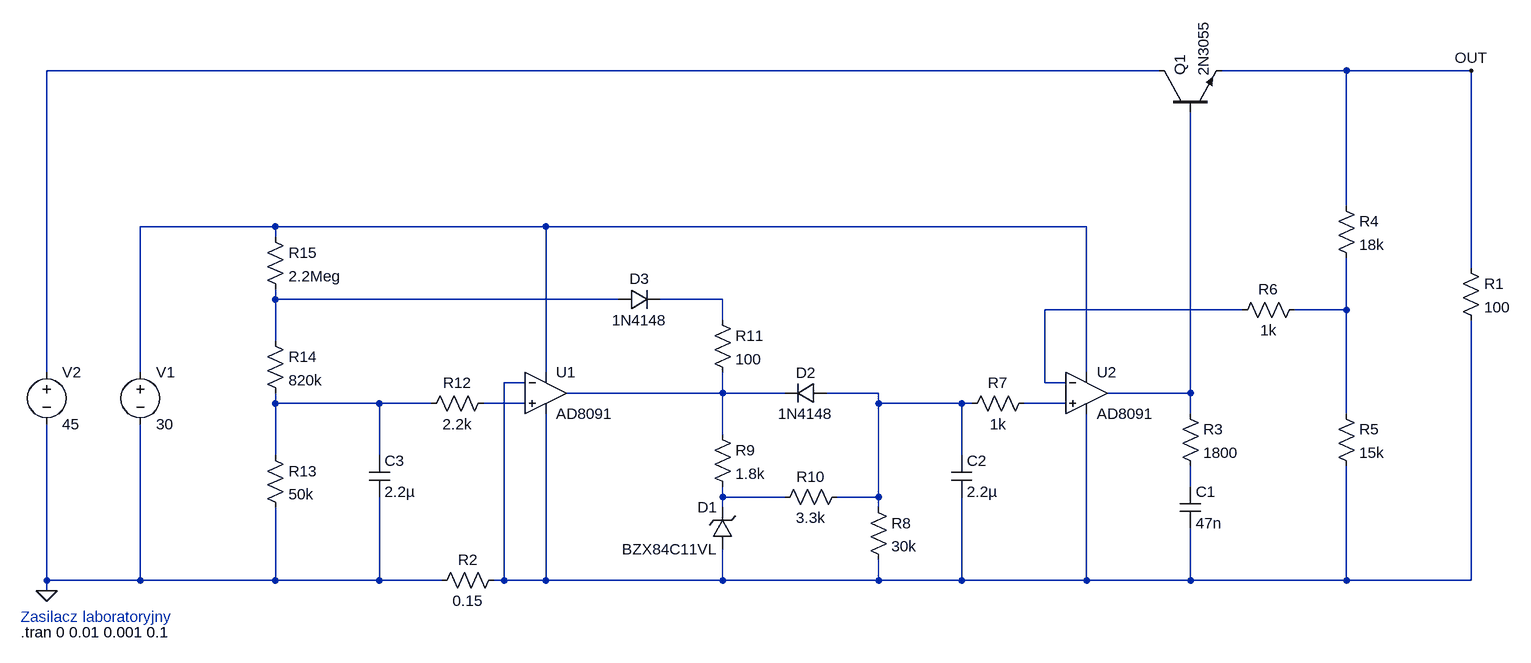
[diagram p0: schematic Lab_voltage_supply.asc]
Lab_voltage_supply.asc, the LTspice schematic file:
Version 4
SHEET 1 1988 768
WIRE 1440 -112 -272 -112
WIRE 1728 -112 1536 -112
WIRE 1920 -112 1728 -112
WIRE 1728 96 1728 -112
WIRE 80 128 -128 128
WIRE 496 128 80 128
WIRE 1328 128 496 128
WIRE 80 144 80 128
WIRE 1920 192 1920 -112
WIRE 80 240 80 224
WIRE 608 240 80 240
WIRE 768 240 672 240
WIRE 1568 256 1264 256
WIRE 1728 256 1728 176
WIRE 1728 256 1648 256
WIRE 768 272 768 240
WIRE 80 304 80 240
WIRE -272 352 -272 -112
WIRE -128 352 -128 128
WIRE 496 352 496 128
WIRE 1328 352 1328 128
WIRE 464 368 432 368
WIRE 1264 368 1264 256
WIRE 1296 368 1264 368
WIRE 768 384 768 352
WIRE 768 384 528 384
WIRE 864 384 768 384
WIRE 1008 384 928 384
WIRE 1488 384 1488 -48
WIRE 1488 384 1360 384
WIRE 80 400 80 384
WIRE 240 400 80 400
WIRE 320 400 240 400
WIRE 464 400 400 400
WIRE 1008 400 1008 384
WIRE 1136 400 1008 400
WIRE 1152 400 1136 400
WIRE 1296 400 1232 400
WIRE 1488 416 1488 384
WIRE 1728 416 1728 256
WIRE 768 448 768 384
WIRE 80 480 80 400
WIRE 240 480 240 400
WIRE 1136 480 1136 400
WIRE 1488 528 1488 496
WIRE 768 544 768 528
WIRE 864 544 768 544
WIRE 1008 544 1008 400
WIRE 1008 544 944 544
WIRE 768 560 768 544
WIRE 1008 560 1008 544
WIRE -272 672 -272 432
WIRE -128 672 -128 432
WIRE -128 672 -272 672
WIRE 80 672 80 560
WIRE 80 672 -128 672
WIRE 240 672 240 544
WIRE 240 672 80 672
WIRE 336 672 240 672
WIRE 432 672 432 368
WIRE 432 672 416 672
WIRE 496 672 496 416
WIRE 496 672 432 672
WIRE 768 672 768 624
WIRE 768 672 496 672
WIRE 1008 672 1008 640
WIRE 1008 672 768 672
WIRE 1136 672 1136 544
WIRE 1136 672 1008 672
WIRE 1328 672 1328 416
WIRE 1328 672 1136 672
WIRE 1488 672 1488 592
WIRE 1488 672 1328 672
WIRE 1728 672 1728 496
WIRE 1728 672 1488 672
WIRE 1920 672 1920 272
WIRE 1920 672 1728 672
WIRE -272 688 -272 672
FLAG -272 688 0
FLAG 1920 -112 OUT
SYMBOL OpAmps\\AD8091 496 320 R0
SYMATTR InstName U1
SYMBOL OpAmps\\AD8091 1328 320 R0
SYMATTR InstName U2
SYMBOL voltage -128 336 R0
WINDOW 123 0 0 Left 0
WINDOW 39 0 0 Left 0
SYMATTR InstName V1
SYMATTR Value 30
SYMBOL voltage -272 336 R0
WINDOW 123 0 0 Left 0
WINDOW 39 0 0 Left 0
SYMATTR InstName V2
SYMATTR Value 45
SYMBOL npn 1440 -48 R270
SYMATTR InstName Q1
SYMATTR Value 2N3055
SYMBOL res 1904 176 R0
SYMATTR InstName R1
SYMATTR Value 100
SYMBOL res 432 656 R90
WINDOW 0 0 56 VBottom 2
WINDOW 3 32 56 VTop 2
SYMATTR InstName R2
SYMATTR Value 0.15
SYMBOL res 1472 400 R0
SYMATTR InstName R3
SYMATTR Value 1800
SYMBOL cap 1472 528 R0
SYMATTR InstName C1
SYMATTR Value 47n
SYMBOL res 1712 80 R0
SYMATTR InstName R4
SYMATTR Value 18k
SYMBOL res 1712 400 R0
SYMATTR InstName R5
SYMATTR Value 15k
SYMBOL res 1664 240 R90
WINDOW 0 0 56 VBottom 2
WINDOW 3 32 56 VTop 2
SYMATTR InstName R6
SYMATTR Value 1k
SYMBOL res 1248 384 R90
WINDOW 0 0 56 VBottom 2
WINDOW 3 32 56 VTop 2
SYMATTR InstName R7
SYMATTR Value 1k
SYMBOL cap 1120 480 R0
SYMATTR InstName C2
SYMATTR Value 2.2µ
SYMBOL res 992 544 R0
SYMATTR InstName R8
SYMATTR Value 30k
SYMBOL zener 784 624 R180
WINDOW 0 24 64 Left 2
WINDOW 3 24 0 Left 2
SYMATTR InstName D1
SYMATTR Value BZX84C11VL
SYMBOL res 752 432 R0
SYMATTR InstName R9
SYMATTR Value 1.8k
SYMBOL res 960 528 R90
WINDOW 0 0 56 VBottom 2
WINDOW 3 32 56 VTop 2
SYMATTR InstName R10
SYMATTR Value 3.3k
SYMBOL diode 928 368 R90
WINDOW 0 0 32 VBottom 2
WINDOW 3 32 32 VTop 2
SYMATTR InstName D2
SYMATTR Value 1N4148
SYMBOL res 752 256 R0
SYMATTR InstName R11
SYMATTR Value 100
SYMBOL diode 608 256 R270
WINDOW 0 32 32 VTop 2
WINDOW 3 0 32 VBottom 2
SYMATTR InstName D3
SYMATTR Value 1N4148
SYMBOL res 416 384 R90
WINDOW 0 0 56 VBottom 2
WINDOW 3 32 56 VTop 2
SYMATTR InstName R12
SYMATTR Value 2.2k
SYMBOL cap 224 480 R0
SYMATTR InstName C3
SYMATTR Value 2.2µ
SYMBOL res 64 464 R0
SYMATTR InstName R13
SYMATTR Value 50k
SYMBOL res 64 288 R0
SYMATTR InstName R14
SYMATTR Value 820k
SYMBOL res 64 128 R0
SYMATTR InstName R15
SYMATTR Value 2.2Meg
TEXT -312 728 Left 2 ;Zasilacz laboratoryjny
TEXT -312 752 Left 2 !.tran 0 0.01 0.001 0.1

The netlist it stands for:
* Lab_voltage_supply.asc
XU1 N012 N007 N002 N007 N008 AD8091  ; pins In+ In- V+ V- OUT
XU2 N013 N005 N002 N007 N010 AD8091  ; pins In+ In- V+ V- OUT
V1 N002 0 30
V2 N001 0 45
Q1 N001 N010 OUT 0 2N3055
R1 OUT N007 100
R2 N007 0 0.15
R3 N010 N014 1800
C1 N014 N007 47n
R4 OUT N006 18k
R5 N006 N007 15k
R6 N006 N005 1k
R7 N013 N009 1k
C2 N009 N007 2.2µ
R8 N009 N007 30k
D1 N007 N015 BZX84C11VL
R9 N008 N015 1.8k
R10 N009 N015 3.3k
D2 N009 N008 1N4148
R11 N004 N008 100
D3 N003 N004 1N4148
R12 N012 N011 2.2k
C3 N011 0 2.2µ
R13 N011 0 50k
R14 N003 N011 820k
R15 N002 N003 2.2Meg
.model D D
.lib standard.dio
.model NPN NPN
.model PNP PNP
.lib standard.bjt
* Zasilacz laboratoryjny
.tran 0 0.01 0.001 0.1
.backanno
.end